# Altium schematic sheet TopMod.SchDoc
size A4
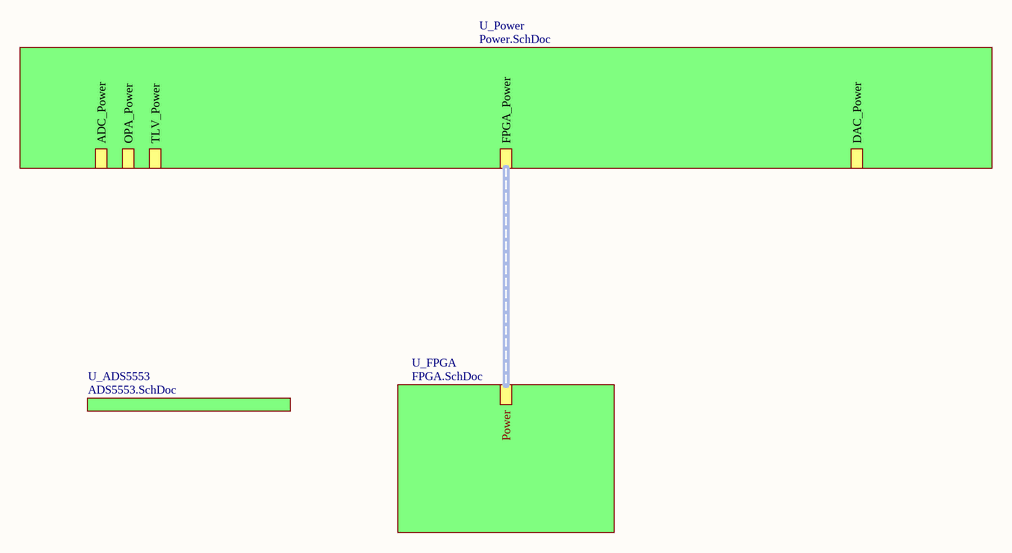
[diagram p0: TopMod.SchDoc]

## Sub-sheets
U_ADS5553 = ADS5553.SchDoc: no entries
U_FPGA = FPGA.SchDoc: Power (harness FPGA_Power)
U_Power = Power.SchDoc: FPGA_Power (harness FPGA_Power), DAC_Power (harness DAC_Power), ADC_Power (harness ADC_Power), OPA_Power (harness OPA_Power), TLV_Power (harness TLV_Power)

## Buses and harness runs
harness sheet U_FPGA/Power = sheet U_Power/FPGA_Power